# Altium schematic sheet preamp.SchDoc
size Letter
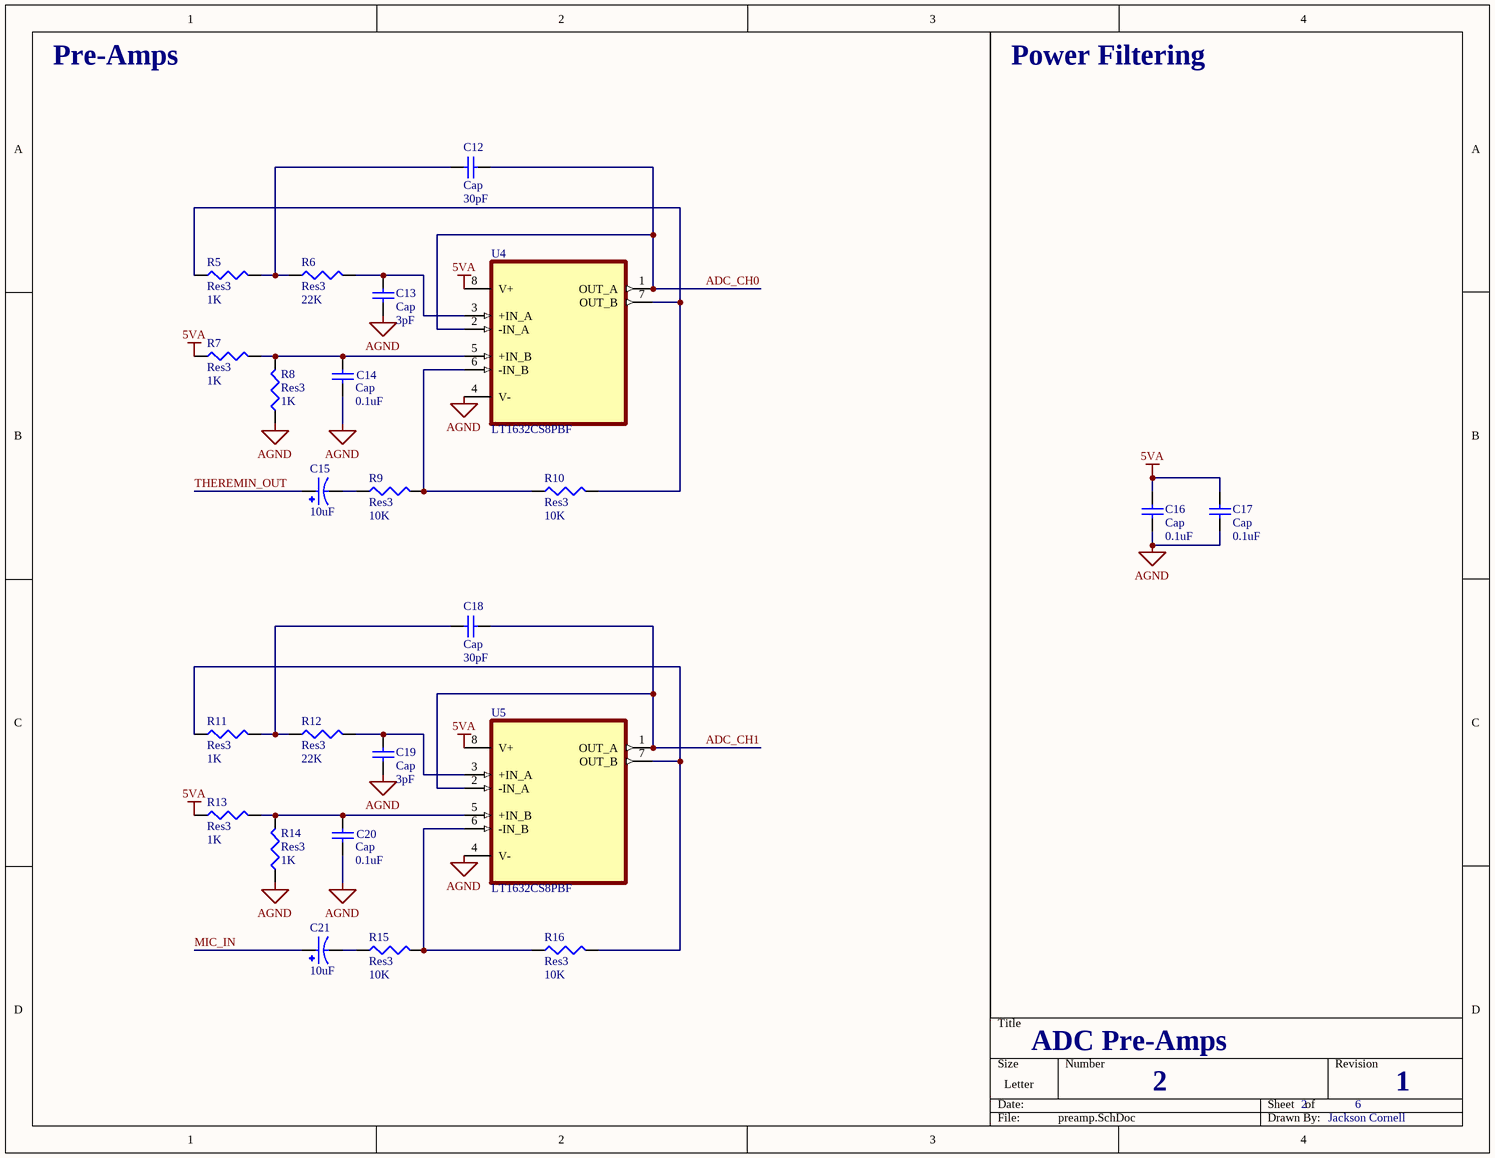
[diagram p0: preamp.SchDoc]

## Parts
C12  Cap  value 30pF  [CAPC0805]
C13  Cap  value 3pF  [CAPC0805]
C14  Cap  value 0.1uF  [CAPC0805]
C15  10uF  [CAPPRD500W50D500H1100]
C16  Cap  value 0.1uF  [CAPC0805]
C17  Cap  value 0.1uF  [CAPC0805]
C18  Cap  value 30pF  [CAPC0805]
C19  Cap  value 3pF  [CAPC0805]
C20  Cap  value 0.1uF  [CAPC0805]
C21  10uF  [CAPPRD500W50D500H1100]
R5  Res3  value 1K  [RES0805]
R6  Res3  value 22K  [RES0805]
R7  Res3  value 1K  [RES0805]
R8  Res3  value 1K  [RES0805]
R9  Res3  value 10K  [RES0805]
R10  Res3  value 10K  [RES0805]
R11  Res3  value 1K  [RES0805]
R12  Res3  value 22K  [RES0805]
R13  Res3  value 1K  [RES0805]
R14  Res3  value 1K  [RES0805]
R15  Res3  value 10K  [RES0805]
R16  Res3  value 10K  [RES0805]
U4  LT1632CS8PBF  [SO-8_S]
U5  LT1632CS8PBF  [SO-8_S]

## Nets
5VA: C16.2 C17.2 R7.1 R13.1 U4.8(V+) U5.8(V+)
AGND: C13.1 C14.1 C16.1 C17.1 C19.1 C20.1 R8.1 R14.1 U4.4(V-) U5.4(V-)
ADC_CH0: C12.2 U4.1(OUT_A) U4.2(-IN_A)
ADC_CH1: C18.2 U5.1(OUT_A) U5.2(-IN_A)
MIC_IN: C21.P
THEREMIN_OUT: C15.P
NetC12_1: C12.1 R5.2 R6.1
NetC13_2: C13.2 R6.2 U4.3(+IN_A)
NetC14_2: C14.2 R7.2 R8.2 U4.5(+IN_B)
NetC15_N: C15.N R9.1
NetC18_1: C18.1 R11.2 R12.1
NetC19_2: C19.2 R12.2 U5.3(+IN_A)
NetC20_2: C20.2 R13.2 R14.2 U5.5(+IN_B)
NetC21_N: C21.N R15.1
NetR5_1: R5.1 R10.2 U4.7(OUT_B)
NetR9_2: R9.2 R10.1 U4.6(-IN_B)
NetR11_1: R11.1 R16.2 U5.7(OUT_B)
NetR15_2: R15.2 R16.1 U5.6(-IN_B)

## Notes on the sheet
- Pre-Amps
- Power Filtering
- ADC Pre-Amps
- 2
- 6
- 1
- Jackson Cornell

## Library data of the parts
C12-C14 C16-C20 = Cap: Capacitor; Published: 8-Jun-2000; LatestRevisionDate: 17-Jul-2002; LatestRevisionNote: Re-released for DXP Platform.; PackageReference: RAD-0.3; Publisher: Altium Limited; PackageDescription: Radial Cap, Thru-Hole; 2 Leads; 0.3 in Pin Spacing
C15 C21 = EEUFS0J221B: Aluminum Electrolytic Capacitors, 220uF, 6.3V, -40 to 105C; MF: Panasonic; Check_prices: https://www.snapeda.com/parts/EEUFS0J221B/Panasonic/view-part/5796863/?ref=eda; Availability: In Stock; Price: None; Package: RADIAL-2 Panasonic; Value: *; SnapEDA_Link: https://www.snapeda.com/parts/EEUFS0J221B/Panasonic/view-part/5796863/?ref=snap; Purchase-URL: https://pricing.snapeda.com/search/part/EEUFS0J221B/?ref=eda; MP: EEUFS0J221B
R5-R16 = Res3: Resistor; Published: 8-Jun-2000; LatestRevisionDate: 29-May-2009; LatestRevisionNote: IPC-7351 Footprint Added.; PackageReference: J1-0603; Publisher: Altium Limited; PackageDescription: Chip Resistor
U4 U5 = LT1632CS8PBF: 45MHz, 45V/ms, Dual/Quad Rail-to-Rail Input and Output  Precision Op Amps; Package: None; Price: None; Value: *; MP: LT1632CS8PBF; Availability: Unavailable